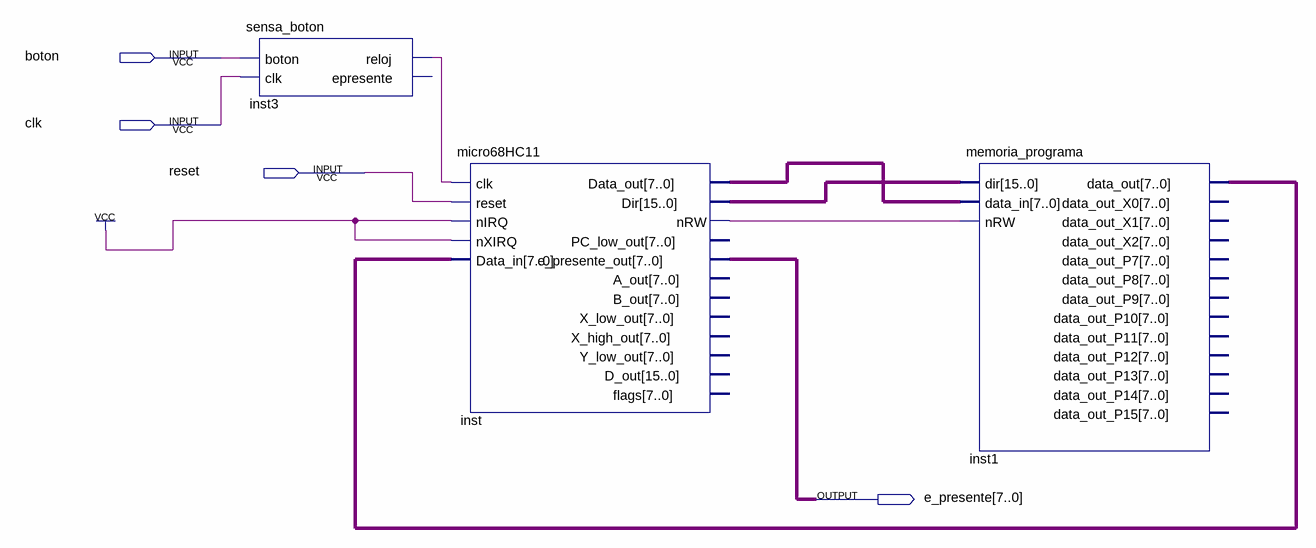
[diagram p0: schematic sheet]
// Quartus schematic microp.bdf as structural Verilog: 3 symbols, 4 pins
module microp (
  input  boton,
  input  clk,
  input  reset,
  output [7:0] e_presente
);

  wire inst3_reloj, inst_nrw;
  wire [7:0] inst1_data_out, inst_data_out;
  wire [15:0] inst_dir;

  sensa_boton inst3 (.boton(boton), .clk(clk), .reloj(inst3_reloj));  // open: epresente
  micro68HC11 inst (
    .clk(inst3_reloj), .reset(reset), .nIRQ(1'b1), .nXIRQ(1'b1), .Data_in(inst1_data_out),
    .Data_out(inst_data_out), .Dir(inst_dir), .nRW(inst_nrw), .e_presente_out(e_presente));  // open: PC_low_out, A_out, B_out, X_low_out, X_high_out, Y_low_out, D_out, flags
  memoria_programa inst1 (
    .dir(inst_dir), .data_in(inst_data_out), .nRW(inst_nrw), .data_out(inst1_data_out));  // open: data_out_X0, data_out_X1, data_out_X2, data_out_P7, data_out_P8, data_out_P9, data_out_P10, data_out_P11, data_out_P12, data_out_P13, data_out_P14, data_out_P15
endmodule
